# Altium project ServoBot.PrjPcb
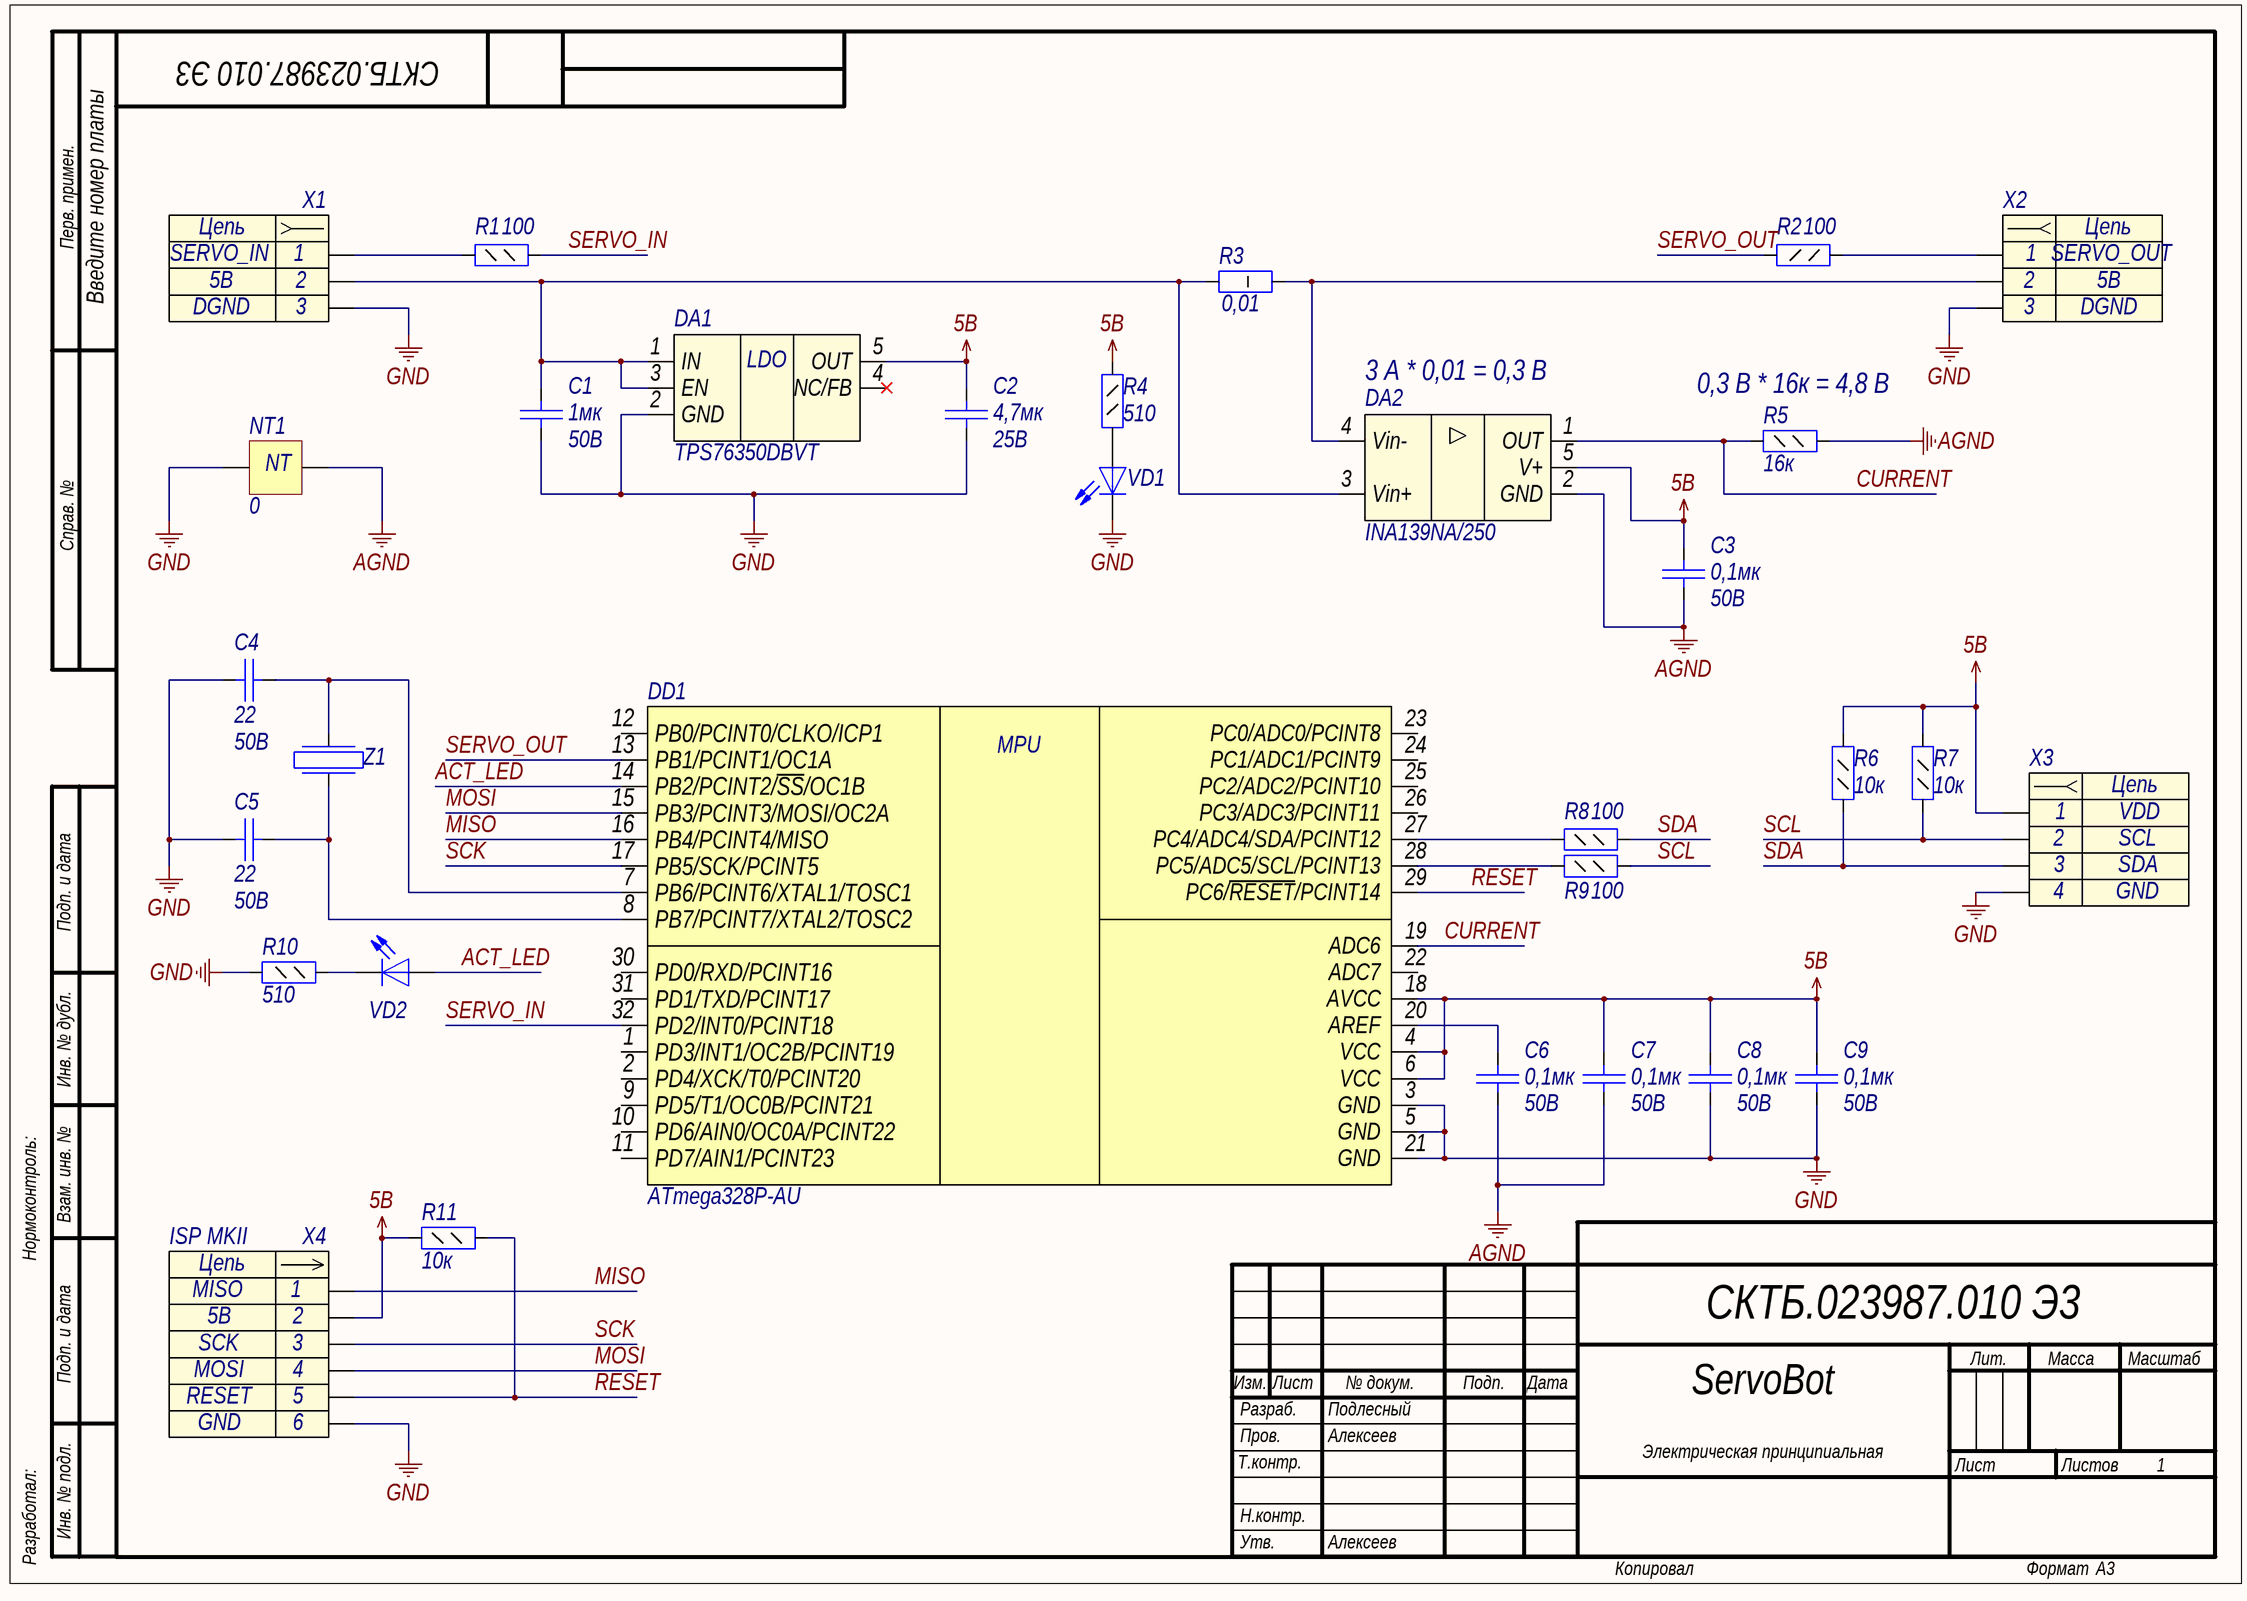
[diagram p0: ServoBot.SchDoc]
1 sheet, 31 parts. Net scope: global (net labels, ports and power ports of the same name join across sheets).
Board file: ServoBot.PcbDoc

## Sheet ServoBot.SchDoc: ServoBot
size 420 x 297 mm; ApprovedBy: Алексеев; CheckedBy: Алексеев; DrawnBy: Подлесный; DocumentNumber: СКТБ.023987.010 Э3; SheetTotal: 1; DocumentType: Электрическая принципиальная; Format: A3; ImagePath: Введите номер платы

### Parts
C1  Voltage: 50B  [C0805]  (hidden comment: 1мк)
C2  Voltage: 25B  [C0805]  (hidden comment: 4,7мк)
C3  value 0,1мк  Voltage: 50B  [C0805]  (hidden comment: Capacitor)
C4  Voltage: 50В  [C0805]  (hidden comment: 22)
C5  Voltage: 50В  [C0805]  (hidden comment: 22)
C6  value 0,1мк  Voltage: 50В  [C0805]  (hidden comment: Capacitor)
C7  value 0,1мк  Voltage: 50В  [C0805]  (hidden comment: Capacitor)
C8  value 0,1мк  Voltage: 50В  [C0805]  (hidden comment: Capacitor)
C9  value 0,1мк  Voltage: 50В  [C0805]  (hidden comment: Capacitor)
DA1  Part Number: TPS76350DBVT  [SOT23-5]  (hidden comment: TPS763x)
DA2  Part Number: INA139NA/250  [SOT23-5]  (hidden comment: INA1x9)
DD1  ATmega328P-AU  [TQFP-32]
NT1  value 0  [Pofigistor0603]  (hidden comment: Pofigistor)  (net tie, no BOM)
R1  value 100  [R0805]  (hidden comment: Resistor_0,125Вт)
R2  value 100  [R0805]  (hidden comment: Resistor_0,125Вт)
R3  value 0,01  [R2512]  (hidden comment: Resistor_1Вт)
R4  value 510  [R0805]  (hidden comment: Resistor_0,125Вт)
R5  value 16к  [R0805]  (hidden comment: Resistor_0,125Вт)
R6  value 10к  [R0805]  (hidden comment: Resistor_0,125Вт)
R7  value 10к  [R0805]  (hidden comment: Resistor_0,125Вт)
R8  value 100  [R0805]  (hidden comment: Resistor_0,125Вт)
R9  value 100  [R0805]  (hidden comment: Resistor_0,125Вт)
R10  value 510  [R0805]  (hidden comment: Resistor_0,125Вт)
R11  value 10к  [R0805]  (hidden comment: Resistor_0,125Вт)
VD1  LED  [L_0805]  (value not drawn)
VD2  LED  [L_0805]  (value not drawn)
X1  Header_3_sct  [PLS-3R]  (value not drawn)
X2  Header_3_sct  [PLS-3R]  (value not drawn)
X3  Header_4_sct  [PLS-4R]  (value not drawn)
X4  ISP MKII  [PLS2-6]
Z1  Crystal  [HC-49S]  (value not drawn)

### Nets
5B: C2.2 C3.2 C7.1 C8.1 C9.1 DA1.5(OUT) DA2.5(V+) DD1.4(VCC) DD1.6(VCC) DD1.18(AVCC) R4.1 R6.2 R7.2 R11.1 X3.1 X4.2
AGND: C3.1 C6.2 C7.2 DA2.2(GND) NT1.2 R5.2
GND: C1.1 C2.1 C4.1 C5.1 C8.2 C9.2 DA1.2(GND) DD1.3(GND) DD1.5(GND) DD1.21(GND) NT1.1 R10.2 VD1.1(K) X1.3 X2.3 X3.4 X4.6
ACT_LED: DD1.14(PB2/PCINT2/~{SS}/OC1B) VD2.2(A)
CURRENT: DA2.1(OUT) DD1.19(ADC6) R5.1
MISO: DD1.16(PB4/PCINT4/MISO) X4.1
MOSI: DD1.15(PB3/PCINT3/MOSI/OC2A) X4.4
RESET: DD1.29(PC6/~{RESET}/PCINT14) R11.2 X4.5
SCK: DD1.17(PB5/SCK/PCINT5) X4.3
SCL: R7.1 R9.2 X3.2
SDA: R6.1 R8.2 X3.3
SERVO_IN: DD1.32(PD2/INT0/PCINT18) R1.2
SERVO_OUT: DD1.13(PB1/PCINT1/OC1A) R2.2
NetC1_2: C1.2 DA1.1(IN) DA1.3(EN) DA2.3(Vin+) R3.1 X1.2
NetC4_2: C4.2 DD1.7(PB6/PCINT6/XTAL1/TOSC1) Z1.2
NetC5_2: C5.2 DD1.8(PB7/PCINT7/XTAL2/TOSC2) Z1.1
NetC6_1: C6.1 DD1.20(AREF)
NetDA2_4: DA2.4(Vin-) R3.2 X2.2
NetDD1_27: DD1.27(PC4/ADC4/SDA/PCINT12) R8.1
NetDD1_28: DD1.28(PC5/ADC5/SCL/PCINT13) R9.1
NetR1_1: R1.1 X1.1
NetR2_1: R2.1 X2.1
NetR4_2: R4.2 VD1.2(A)
NetR10_1: R10.1 VD2.1(K)

Not connected (* = marked no-connect by the designer): DA1 4(NC/FB)*; DD1 1(PD3/INT1/OC2B/PCINT19) 2(PD4/XCK/T0/PCINT20) 9(PD5/T1/OC0B/PCINT21) 10(PD6/AIN0/OC0A/PCINT22) 11(PD7/AIN1/PCINT23) 12(PB0/PCINT0/CLKO/ICP1) 22(ADC7) 23(PC0/ADC0/PCINT8) 24(PC1/ADC1/PCINT9) 25(PC2/ADC2/PCINT10) 26(PC3/ADC3/PCINT11) 30(PD0/RXD/PCINT16) 31(PD1/TXD/PCINT17)

### Notes on the sheet
- Перв. примен.
- (near DA2) 3 А * 0,01 = 0,3 В
- (near R5) 0,3 В * 16к = 4,8 В
- Справ. №
- Подп. и дата
- Инв. № дубл.
- Нормоконтроль:
- Взам. инв. №
- Изм.
- Лист
- № докум.
- Подп.
- Дата
- Лит.
- Масса
- Масштаб
- Т.контр.
- Пров.
- Разраб.
- Листов
- Разработал:
- Инв. № подл.
- Н.контр.
- Утв.
- Копировал
- Формат
- (in symbol connect40) Цепь
- (in symbol connect126) Цепь
- (in symbol connect127) Цепь
- (in symbol microcont1) MPU
- (in symbol pwr50) LDO
- (in symbol res970) NT

### Library data of the parts
C1 = cap151: Конденсатор; Part Name: Ceramic; Manufacture: Murata; Part Number: GRM21BR71H105K; id: cap151; TKE: X7R; Value: 1мк
C2 = cap153: Конденсатор; Part Name: Ceramic; Manufacture: Murata; Part Number: GRM21BR61E475KA12L; id: cap153; TKE: X5R; Value: 4,7мк
C3 = cap153: Конденсатор; Part Number: GRM21BR71E225K; Part Name: Capacitors; id: cap153; TKE: X7R
C4 C5 = cap223: Конденсатор; Part Name: Ceramic; Manufacture: Murata; Part Number: GRM21A5C2E220JW01D; id: cap223; TKE: X7R; Value: 22
C6-C9 = cap162: Конденсатор; Part Name: Ceramic; Manufacture: Murata; Part Number: GRM216R71H221K; id: cap162; TKE: X7R
DA1 = pwr50: Low-Dropout Regulator; Manufacturer: Texas Instruments; id: pwr50; Input Voltage: 2,7-10B; Output Voltage: 5B; Dropout Voltage: 300mV; Current: 150mA; Part Name: Low-Dropout Regulator; Type: Linear
DA2 = amp3: Измерительный датчик тока; Part Name: Measurement Current Shunt Monitor; Manufacture: Texas Instruments; id: amp3; Rail-to-rail: independent; Supply Voltage: 2,7-5-40B; Supply Current max: 60uA; Bandwidth: rout=20  220kHz; Input Bias Current: 10uA; CMRR: 115dB; Offset voltage: 0,2mB; Channels: 1
DD1 = microcont1: Микроконтроллер 8-Бит, picoPower, AVR, 20МГц, 32КБ Flash; Part Name: Microcontroller; Frequency: 20MHz; ADC: 8x10b; Interface: i2c, spi, uart; Flash: 32kb; Pin in: 23; Power Supply: 1.8-5.5 V; id: microcont1; Part Number: ATmega328P-AU
NT1 = res970: Part Name: NET TIE; id: res970
R1 R2 R8 R9 = res49: Резистор; Manufacture: Yageo; Part Number: RC0805FR-07100RL; id: res49; Accuracy: 1%; Part Name: Resistor; Power: 0,125Вт
R3 = res772: Резистор; Manufacture: Yageo; Part Number: RC2512FR-070RL; id: res772; Power: 1Вт; Part Name: Resistor; Accuracy: 0,01
R4 = res66: Резистор; Manufacture: Yageo; Part Number: RC0805FR-07510RL; id: res66; Accuracy: 0,01; Part Name: Resistor; Power: 0,125Вт
R5 = res106: Резистор; Manufacture: Yageo; Part Number: RC0805FR-0716KL; id: res106; Accuracy: 0,01; Part Name: Resistor; Power: 0,125Вт
R6 R7 R10 R11 = res97: Резистор; Manufacture: Yageo; Part Number: RC0805FR-0710KL; id: res97; Accuracy: 1%; Part Name: Resistor; Power: 0,125Вт
VD1 VD2 = diode5: Светодиод; Part Number: KP-2012EC; id: diode5; Part Name: LED
X1 = connect126: Разъем - 3 конт. розетка; Part Number: DS1022-1*3RDF11-B; Manufacture: Ningbo connfly electronic; Contact_1: SERVO_IN; Contact_2: 5B; Contact_3: DGND; Etch: 2.54mm; Part Name: PLS-3R; id: connect126
X2 = connect126: Разъем - 3 конт. розетка; Part Number: DS1022-1*3RDF11-B; Manufacture: Ningbo connfly electronic; Contact_1: SERVO_OUT; Contact_2: 5B; Contact_3: DGND; Etch: 2.54mm; Part Name: PLS-3R; id: connect126
X3 = connect127: Разъем - 4 конт. розетка; Part Number: DS1022-1*4RDF11-B; Manufacture: Ningbo connfly electronic; Contact_1: VDD; Contact_2: SCL; Contact_3: SDA; Contact_4: GND; Etch: 2.54mm; Part Name: PLS-4R; id: connect127
X4 = connect40: Разъем - 6 конт. вилка; Contact_1: MISO; Contact_2: 5B; Contact_3: SCK; Contact_4: MOSI; Contact_5: RESET; Contact_6: GND; Part Name: MKII; id: connect40
Z1 = crystal7: Кварцевый резонатор; Part Number: 16.000MHzHC-49US; Frequence: 16MHz; id: crystal7